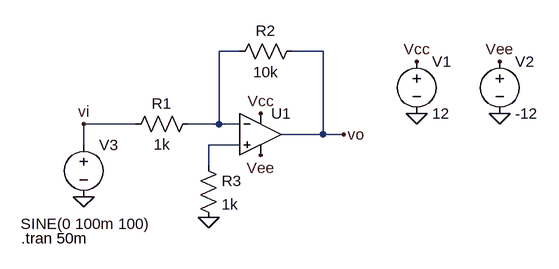
[diagram p0: schematic inverting_opamp.asc]
inverting_opamp.asc, the LTspice schematic file:
Version 4
SHEET 1 880 680
WIRE 96 32 64 32
WIRE 224 32 176 32
WIRE -64 144 -144 144
WIRE 64 144 64 32
WIRE 64 144 16 144
WIRE 96 144 64 144
WIRE 224 160 224 32
WIRE 224 160 160 160
WIRE 256 160 224 160
WIRE -144 176 -144 144
WIRE 96 176 48 176
WIRE 48 208 48 176
FLAG 368 128 0
FLAG 368 48 Vcc
FLAG 496 128 0
FLAG 496 48 Vee
FLAG 128 128 Vcc
FLAG 128 192 Vee
FLAG 256 160 vo
FLAG 48 288 0
FLAG -144 256 0
FLAG -144 144 vi
SYMBOL voltage 368 32 R0
WINDOW 123 0 0 Left 0
WINDOW 39 0 0 Left 0
SYMATTR InstName V1
SYMATTR Value 12
SYMBOL voltage 496 32 R0
WINDOW 123 0 0 Left 0
WINDOW 39 0 0 Left 0
SYMATTR InstName V2
SYMATTR Value -12
SYMBOL res 32 128 R90
WINDOW 0 0 56 VBottom 2
WINDOW 3 32 56 VTop 2
SYMATTR InstName R1
SYMATTR Value 1k
SYMBOL res 192 16 R90
WINDOW 0 0 56 VBottom 2
WINDOW 3 32 56 VTop 2
SYMATTR InstName R2
SYMATTR Value 10k
SYMBOL res 32 192 R0
SYMATTR InstName R3
SYMATTR Value 1k
SYMBOL voltage -144 160 R0
WINDOW 3 -97 138 Left 2
WINDOW 123 0 0 Left 0
WINDOW 39 0 0 Left 0
SYMATTR Value SINE(0 100m 100)
SYMATTR InstName V3
SYMBOL Opamps\\UniversalOpamp2 128 160 R0
SYMATTR InstName U1
TEXT -240 320 Left 2 !.tran 50m

The netlist it stands for:
* inverting_opamp.asc
V1 Vcc 0 12
V2 Vee 0 -12
R1 N001 vi 1k
R2 vo N001 10k
R3 N002 0 1k
V3 vi 0 SINE(0 100m 100)
XU1 N002 N001 Vcc Vee vo level.2 Avol=1Meg GBW=10Meg Slew=10Meg ilimit=25m rail=0 Vos=0 phimargin=45 en=0 enk=0 in=0 ink=0 Rin=500Meg  ; pins IN+ IN- V+ V- OUT
.tran 50m
.lib UniversalOpamps2.sub
.backanno
.end